# Altium project 06_TIME_STICK_279.PrjPcb (part 2 of 2)
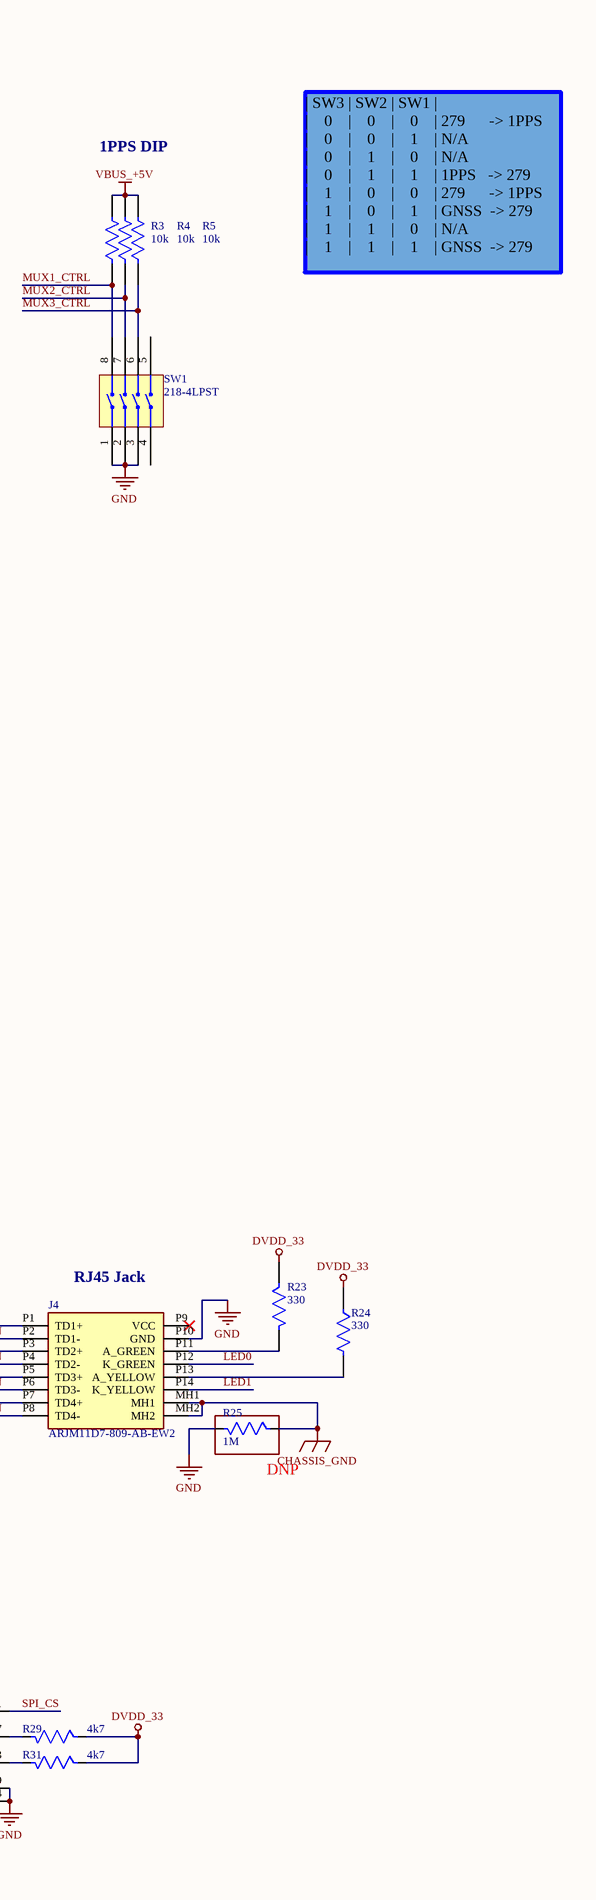
[diagram p2: Sheet1.SchDoc, right]

## Sheet Sheet1.SchDoc (continued)

### Library data of the parts
C1-C5 C8 C9 C14-C18 C20-C27 C30-C34 = CMP-13271-002758-1: Cap Ceramic 100nF 10V X7R ±10% SMD 0402 +125°C Paper T/R; Manufacturer: KEMET; Manufacturer Part Number: C0402C104K4RAC-TU; Voltage: 16V; Dissipation Factor: 3.5%; Voltage Rating: 10V; Voltage Rating (DC): 10V; Packaging: Tape and Reel; Radiation Hardening: No; Height: 0.5mm; Depth: 0.5mm; Package Quantity: 50000; Tolerance: 10%; Mount: Surface Mount; Width: 0.02inch; Thickness: 0.022inch; Max Operating Temperature: 125°C; Capacitance: 100nF; Dielectric: X7R; Case/Package: 0402; Length: 1mm; Min Operating Temperature: -55°C; Supplier: Digikey; Supplier Part Number: 399-C0402C104K4RAC7867CT-ND; RoHS: Yes; Category: Ceramic Capacitors; Stock: 3965396; Pricing: 1=0.1, 10=0.032, 50=0.0182, 100=0.0141, 500=0.0106, 1000=0.00833, 2500=0.00758, 5000=0.00697 (USD); Pins: 2; Case Code (Metric): 1005; Case Code (Imperial): 0402; Dielectric Material: Ceramic; Value: 100nF; Termination: SMD/SMT; Series: C; Reach SVHC Compliant: No
C6 C12 C13 C19 C28 = CMP-14477-004104-2: Ceramic Capacitor General Use 4.7uF ±20% 10V X5R 0402; Manufacturer: Taiyo Yuden; Manufacturer Part Number: LMK105BBJ475MVLF; Material: 4241ConductorMaterial; Case Code (Metric): 1005; Package Quantity: 10000; Max Operating Temperature: 85°C; Halogen Free: Halogen Free; Case Code (Imperial): 0402; Weight: 2.3E-05oz; Packaging: Tape and Reel; Resistor Type: Ceramic; Width: 0.02inch; Case/Package: 0402; Min Operating Temperature: -55°C; Dielectric: X5R; Length: 1mm; RoHS Compliant: Yes; Capacitance: 4.7uF; Thickness: 0.022inch; Termination: SMD/SMT; Voltage Rating (DC): 10V; Voltage Rating: 10V; Mount: Surface Mount; Tolerance: 20%; Height: 0.5mm; Supplier: Digikey; Supplier Part Number: 587-3408-1-ND; RoHS: Yes; Category: Ceramic Capacitors; Stock: 753964; Pricing: 1=0.19, 10=0.12, 50=0.076, 100=0.0607, 500=0.04386, 1000=0.03879, 2500=0.03711, 5000=0.03373 (USD); Mounting Technology: Surface Mount; Value: 4.7uF; Series: M; Construction: Flat; ComponentLink1URL: https://datasheet.ciiva.com/24462/423lmk105bbj475mvlf-24462535.pdf?src-supplier=Onlinecomponents.com; ComponentLink1Description: https://datasheet.ciiva.com/24462/423lmk105bbj475mvlf-24462535.pdf?src-supplier=Onlinecomponents.com; ComponentLink2URL: https://datasheet.ciiva.com/18697/mlcc-all-e-18697686.pdf?src-supplier=Digikey; ComponentLink2Description: https://datasheet.ciiva.com/18697/mlcc-all-e-18697686.pdf?src-supplier=Digikey; ComponentLink3URL: https://datasheet.ciiva.com/18697/mlcc-all-e-18697685.pdf?src-supplier=Digikey; ComponentLink3Description: https://datasheet.ciiva.com/18697/mlcc-all-e-18697685.pdf?src-supplier=Digikey
C7 C29 = CMP-2000-05441-1: Chip Capacitor, 22 uF, +/- 20%, 10 V, -55 to 85 degC, 0603 (1608 Metric), RoHS, Tape and Reel; Manufacturer: TDK; PCN Part Number: MLCCPartNumberChange30/Nov/2012; Manufacturer Part Number: C1608X5R1A226M080AC; Voltage - Rated: 10V; Product Training Modules: CSeriesGeneralApplicationsSEAT,CCV,andTVCLDesignToolsGuidetoReplacinganElectrolyticCapacitorwithanMLCC; Other Names: 445-9077-1; Design Resources: 20WNon-IsolatedBuckLEDDriverUsingPLLNK460KG; Online Catalog: CSeries,GeneralPurpose; Capacitance: 22µF; Temperature Coefficient: X5R; Kits: 445-9014-KIT-ND-KITMLCC100PF-22UF060310-50V; Dielectric Material: Ceramic; Material: 4241ConductorMaterial; Packaging: CutTape(CT); Standard Package: 1; Package / Case: 0603(1608Metric); Lead Style: -; Features: -; Ratings: -; Operating Temperature: -55degC~85degC; Applications: GeneralPurpose; Package Reference: 603; Datasheet URL: http://download.siliconexpert.com/pdfs/2015/4/21/15/54/45/779/tdk_/manual/37024850441143360mlcc_commercial_general_en.pdf; Datasheet Version: Mar-15; Mounting Type: SurfaceMount,MLCC; Lead Spacing: -; Size / Dimension: 0.063"Lx0.031"W(1.60mmx0.80mm); Height - Seated (Max): -; Package Description: 2-Pin Surface Mount Device, Body 1.6 x 0.8 mm; Manufacturer URL: http://www.tdk.com/; RoHS Information: RoHSCertificate-MLCC; Tolerance: ±20%; Series: C; Thickness (Max): 0.035"(0.90mm); Family: CeramicCapacitors; Category: Capacitors; Supplier: Digikey; Supplier Part Number: 445-9077-1-ND; RoHS: Yes; Stock: 1433584; Pricing: 1=0.33, 10=0.219, 50=0.1612, 100=0.1312, 500=0.1036, 1000=0.08748 (USD); Mounting Technology: Surface Mount; Case/Package: 0603; Case Code (Metric): 1608; Case Code (Imperial): 0603; Weight: 7.1E-05oz; Min Operating Temperature: -55°C; Max Operating Temperature: 85°C; Voltage Rating: 10V; Value: 22uF; Voltage Rating (DC): 10V; Dielectric: X5R; Termination: SMD/SMT; Package Quantity: 4000; Length: 1.6mm; Width: 0.8mm; Height: 0.8mm; RoHS Compliant: Yes; Lead Free: Lead Free; Reach SVHC Compliant: No; ComponentLink1URL: https://datasheet.ciiva.com/6274/tdkmlcccaprange-6274860.pdf?src-supplier=Digikey; ComponentLink1Description: https://datasheet.ciiva.com/6274/tdkmlcccaprange-6274860.pdf?src-supplier=Digikey; ComponentLink2URL: https://datasheet.ciiva.com/6274/tdkmlcccaprange-6274859.pdf?src-supplier=Digikey; ComponentLink2Description: https://datasheet.ciiva.com/6274/tdkmlcccaprange-6274859.pdf?src-supplier=Digikey; ComponentLink3URL: https://datasheet.ciiva.com/6274/tdkmlcccaprange-6274861.pdf?src-supplier=Digikey; ComponentLink3Description: https://datasheet.ciiva.com/6274/tdkmlcccaprange-6274861.pdf?src-supplier=Digikey; ComponentLink4URL: https://datasheet.ciiva.com/24216/mlcc-commercial-general-en-24216575.pdf?src-supplier=Mouser; ComponentLink4Description: https://datasheet.ciiva.com/24216/mlcc-commercial-general-en-24216575.pdf?src-supplier=Mouser
C10 C11 = CMP-03020-019954-1: CAP CER 15PF 100V C0G/NP0 0402; Manufacturer: KEMET; Manufacturer Part Number: CBR04C150F1GAC; Tolerance: 0.01; Temperature Coefficient: 30ppm/°C; Temperature Characteristic: C0G; Material: Ceramic; Temperature Range High: +125°C; Device Class L1: Passive Components; Package: CBR04C; Height: 0.55mm; RoHS: TRUE; Octopart: https://octopart.com/cbr04c150f1gac-kemet-30609229; Value: 15 pF; Temperature Range Low: -55°C; Digikey Description: CAP CER 15PF 100V C0G/NP0 0402; Mouser Description: Multilayer Ceramic Capacitors MLCC - SMD/SMT 100volts 15pF C0G 0402 1% Tol RF; Automotive: No; Temperature: -55°C to +125°C; Category: Cap; Lead Free: Yes; Capacitance: 15 pF; Ipc Land Pattern Name: CAPC10050X50; ComponentLink2Description: Datasheet; Voltage Rating: 100 V; Device Class L3: Ceramic Capacitors; Device Class L2: Capacitors; ComponentLink2URL: https://content.kemet.com/datasheets/KEM_C1030_CBR_SMD.pdf
D1 D2 = CMP-44529-000024-1: LED GREEN CLEAR CHIP SMD; Manufacturer: Kingbright; Forward Voltage: 3.3V; Dominant Wavelength: 525nm; Forward Current: 20mA; Lens Color: Colorless; Viewing Angle: 120°; Luminous Intensity: 350mcd; Lens Transparency: Clear; Color: Green; Max Operating Temperature: 85°C; Case/Package: 0603; Mount: Surface Mount; Min Operating Temperature: -40°C; Case Code (Metric): 1608; Test Current: 20mA; Packaging: Tape and Reel; Width: 0.8mm; Package Quantity: 1; Height: 0.75mm; Length: 1.6mm; Illumination Color: Green; Lead Free: Lead Free; Case Code (Imperial): 0603; Supplier: LCSC; Supplier Part Number: C5554158; Manufacturer Part Number: APT1608ZGCK; RoHS: Yes; Category: LEDs; Stock: 1770; Pricing: 5=0.3043, 50=0.2442, 150=0.2184, 500=0.1863, 2000=0.1719, 4000=0.1633 (USD); Mounting Technology: Surface Mount; Series: HELI2; RoHS Compliant: Yes; ComponentLink1URL: https://datasheet.ciiva.com/16422/apt1608zgck-262051-16422477.pdf?src-supplier=Mouser; ComponentLink1Description: https://datasheet.ciiva.com/16422/apt1608zgck-262051-16422477.pdf?src-supplier=Mouser; ComponentLink2URL: https://datasheet.ciiva.com/26292/apt1608zgck-26292289.pdf?src-supplier=Digikey; ComponentLink2Description: https://datasheet.ciiva.com/26292/apt1608zgck-26292289.pdf?src-supplier=Digikey; ComponentLink3URL: https://datasheet.ciiva.com/29562/apt1608zgck-29562277.pdf?src-supplier=Digikey; ComponentLink3Description: https://datasheet.ciiva.com/29562/apt1608zgck-29562277.pdf?src-supplier=Digikey
FB1-FB4 = CMP-0686-00284-4: Chip Ferrite Bead, 0402, 80Ω @ 100MHz, 0.07Ω, 25%, 1.5A; Manufacturer: Murata; Number of Lines: 1; DC Resistance-Max: 70mR; Impedance: 80R; Height: 0.5mm; Package Quantity: 1; RoHS Compliant: Yes; Max Operating Temperature: 125°C; Depth: 0.5mm; Max Current Rating: 1.5A; Max DC Current: 1.5A; Current Rating: 1.5A; Number of Pins: 2; Case Code (Imperial): 0402; Case/Package: 0402; Case Code (Metric): 1005; Material: Ferrite; Packaging: Tape and Reel; REACH SVHC: No SVHC; Length: 1mm; Tolerance: 25%; Termination: SMD/SMT; Series: BLM15PD; Number of Circuits: 1; Test Frequency: 100MHz; DC Resistance (DCR): 70mR; Min Operating Temperature: -55°C; Lead Free: Lead Free; Width: 0.5mm; Supplier: Digikey; Supplier Part Number: 490-5202-1-ND; Manufacturer Part Number: BLM15PD800SN1D; RoHS: Yes; Category: Ferrite Beads and Chips; Stock: 94761; Pricing: 1=0.1, 10=0.068, 25=0.0616, 50=0.0556, 100=0.0408, 250=0.02968, 500=0.0272, 1000=0.02348, 5000=0.01854 (USD); Pins: 2; Reach SVHC Compliant: No; ComponentLink1URL: https://datasheet.ciiva.com/41449/001172208-da-01-en-drossel-0402-80r-1-0x0-5mm-10000st-41449497.pdf?src-supplier=Conrad; ComponentLink1Description: https://datasheet.ciiva.com/41449/001172208-da-01-en-drossel-0402-80r-1-0x0-5mm-10000st-41449497.pdf?src-supplier=Conrad; ComponentLink2URL: https://datasheet.ciiva.com/1012/l0110e-1012441.pdf?src-supplier=Digikey; ComponentLink2Description: https://datasheet.ciiva.com/1012/l0110e-1012441.pdf?src-supplier=Digikey; ComponentLink3URL: https://datasheet.ciiva.com/1012/l0110e-1012440.pdf?src-supplier=Digikey; ComponentLink3Description: https://datasheet.ciiva.com/1012/l0110e-1012440.pdf?src-supplier=Digikey; ComponentLink4URL: https://datasheet.ciiva.com/1012/l0110e-1012442.pdf?src-supplier=Digikey; ComponentLink4Description: https://datasheet.ciiva.com/1012/l0110e-1012442.pdf?src-supplier=Digikey; ComponentLink5URL: https://datasheet.ciiva.com/16420/l0110s0100blm15pgblm15pd-16420757.pdf?src-supplier=Future+Electronics; ComponentLink5Description: https://datasheet.ciiva.com/16420/l0110s0100blm15pgblm15pd-16420757.pdf?src-supplier=Future+Electronics
J1 = CMP-04764-000006-1: CONN SMA JACK STR 50 OHM SMD; Manufacturer: Molex; Manufacturer Series: 73251; Is Female: yes; Standoff Height: 0.41mm; Impedance: 50Ω; Number Of Contacts: 1; Conn Orientation: Straight; Voltage Rating: 500V; Shielding: true; Frequency: 18GHz; Characteristic Impedance: 50R; Contact Resistance: 3mR; Contact Style: Coax; Dielectric Withstanding Voltage (AC): 1.4kV; Durability: 500Cycles; Insertion Loss: 0.17dB; Insulation Resistance: 5GR; Operating Frequency-Max: 18kHz; VSWR: 1.07; Body Depth: 0.375inch; Mounting Option 1: LOCKING; Reliability: COMMERCIAL; Package: 73251-1350; Device Class L1: Connectors; Category: Conn; Manufacturer Part Number: 73251-1350; ComponentLink2URL: https://www.molex.com/pdm_docs/sd/732511350_sd.pdf; Automotive: No; Height: 9.655mm; Octopart: https://octopart.com/73251-1350-molex-5414390; Footprint Url: https://forum.upverter.com/uploads/default/original/3X/d/a/daeafa2ce4908d4fc4e49f0b17d7d2c986fce444.pdf; Temperature Range High: +165°C; Device Class L3: unset; Mouser Description: RF Connectors / Coaxial Connectors SMA ST PCB-JCK STD SMT; Lead Free: Yes; Temperature: -65°C to +165°C; RoHS: TRUE; ComponentLink2Description: Datasheet; Device Class L2: RF / Coaxial Connectors; Digikey Description: CONN SMA JACK STR 50 OHM SMD; Contact Material: Gold; Temperature Range Low: -65°C; Supplier: Digikey; Supplier Part Number: WM9357-ND; Stock: 5647; Pricing: 1=4.22, 10=3.712, 80=2.95275, 1600=2.36223, 3200=2.27786 (USD); Mounting Technology: Board; Contact Finish - Mating: NOT SPECIFIED; Insulation Material: Teflon; Shell Finish: Gold; Shell Material: Brass; Min Operating Temperature: -65°C; Max Operating Temperature: 165°C; Connector Type: SMA; Body/Shell Style: JACK; Contact Gender: Female; Mounting Style: STRAIGHT; Termination: SMD/SMT; Number of Ports: 1; Panel Mount: Yes; RoHS Compliant: Yes; Reach SVHC Compliant: No; ComponentLink1URL: https://datasheet.ciiva.com:443/pdfs/VipMasterIC/IC/MOLE/MOLE-S-A0001396055/MOLE-S-A0001473074-1.pdf?src-supplier=IHS+Markit; ComponentLink1Description: https://datasheet.ciiva.com:443/pdfs/VipMasterIC/IC/MOLE/MOLE-S-A0001396055/MOLE-S-A0001473074-1.pdf?src-supplier=IHS+Markit
J2 = CMP-CON-00539-2: CONN, B2C/W, HEADER, 5-POS, 1.00MM PITCH, 2.90MM H, RA, TIN, SMT; Manufacturer: JST Sales America Inc.; Internal Part Number: 830-02819-00; Rows: 1; Shrouded: Shrouded - 4 Wall; System: Connector; Insulation: Polyamide (PA), Nylon; Current Rating: 0.7A; Pitch: 0.039" (1.00mm); Style: Board to Cable/Wire; Number of Positions/Contacts: 5; Voltage Rating: 50V; Contact Material: Copper Alloy; Supplier Part Number 1: 455-SM05B-SRSS-G-TBTR-ND; Category: Headers, Male Pins; Color: Natural; Series: SH/SR; Supplier 1: Digikey; Max Operating Temperature: 85°C; Contact Shape: Square; Contact Finish: Tin; Mounting Type: Surface Mount, Right Angle; Part Status: Active; Contact Type: Male Pin; Termination: Solder; Datasheet URL: https://www.jst-mfg.com/product/pdf/eng/eSH.pdf?65e8c309183bb; Signal Pins: 5; Height: 0.114" (2.90mm); RoHS: Yes; Features: Solder Retention; Min Operating Temperature: -25°C; Connector Type: Header
J3 = CONN_GSB316441CEU: Conn USB 3.0 Type A PL 9 POS Solder RA SMD 9 Terminal 1 Port; Manufacturer: Amphenol Commercial; MF: Amphenol; Current Rating: 1.8A; Number of Contacts: 9; SnapEDA_Link: https://www.snapeda.com/parts/GSB316441CEU/Amphenol/view-part/?ref=snap; Package: None; Value: *; MP: GSB316441CEU; Check_prices: https://www.snapeda.com/parts/GSB316441CEU/Amphenol/view-part/?ref=eda; Supplier: Digikey; Supplier Part Number: GSB316441CEUCT-ND; Manufacturer Part Number: GSB316441CEU; RoHS: Yes; Category: USB Connectors; Stock: 13312; Pricing: 1=2.04, 10=1.775, 25=1.6996, 50=1.6618, 100=1.5863, 250=1.43524 (USD); Mounting Technology: Surface Mount,Horizontal; Contact Material: Copper Alloy; Contact Plating: Gold; Package Quantity: 1; Packaging: Tape and Reel; Connector Type: USB; Termination: SMD/SMT; Orientation: Right Angle; Series: GSB3; Radiation Hardening: No; RoHS Compliant: Yes; ComponentLink1URL: https://datasheet.ciiva.com/10945/gsb316441ceu-10945197.pdf?src-supplier=Avnet; ComponentLink1Description: https://datasheet.ciiva.com/10945/gsb316441ceu-10945197.pdf?src-supplier=Avnet; Supplier 1: Digikey; Supplier Part Number 1: GSB316441CEUCT-ND
J4 = ARJM11D7-809-AB-EW2: Connector; Manufacturer_Name: ABRACON; Datasheet Link: https://abracon.com/Magnetics/ARJM11.pdf; Height: 14.05mm; Manufacturer_Part_Number: ARJM11D7-809-AB-EW2; Mouser Part Number: 815-RJM11D7809ABEW2; Mouser Price/Stock: https://www.mouser.co.uk/ProductDetail/ABRACON/ARJM11D7-809-AB-EW2?qs=YCa%2FAAYMW03gbQ6lIqrJ2w%3D%3D; Arrow Part Number: ARJM11D7-809-AB-EW2; Arrow Price/Stock: null?region=nac
L1 L2 = CMP-06042-016211-1: Multilayer Type Inductor for Power Lines, 1008 (2520), 3.3μH, 20%, 0.125Ω, 1.2A; Manufacturer: Murata; Manufacturer Part Number: LQM2HPN3R3MG0L; Self Resonant Frequency: 30MHz; Inductance: 3.3uH; Shielding: Shielded; DC Resistance (DCR): 125mR; Test Frequency: 1MHz; Core Material: Ferrite; Value: 3.3uH; Case Code (Imperial): 1008; Width: 2mm; Lead Free: Lead Free; Inductance Tolerance: 20%; Radiation Hardening: No; Mount: Surface Mount; Packaging: Tape and Reel; Case Code (Metric): 2520; Height: 0.9mm; Military Standard: Not; Tolerance: 20%; Max DC Current: 1.2A; Min Operating Temperature: -55°C; Length: 2.5mm; Depth: 2.2mm; Case/Package: 1008; Max Operating Temperature: 125°C; Series: LQM2HP_G0; RoHS Compliant: Yes; Height - Seated (Max): 0.039inch; REACH SVHC: No SVHC; DC Current: 1.2A; Package Quantity: 3000; Termination: SMD/SMT; Current Rating: 1.2A; Supplier: Digikey; Supplier Part Number: 490-5115-1-ND; RoHS: Yes; Category: Fixed Inductors; Stock: 32510; Pricing: 1=0.21, 10=0.171, 25=0.1576, 50=0.1444, 100=0.1274, 250=0.12344, 500=0.11032, 1000=0.0893 (USD); Mounting Technology: Surface Mount; Reach SVHC Compliant: No; ComponentLink1URL: https://datasheet.ciiva.com/30490/0900766b812561d9-30490184.pdf?src-supplier=Rs; ComponentLink1Description: https://datasheet.ciiva.com/30490/0900766b812561d9-30490184.pdf?src-supplier=Rs; ComponentLink2URL: https://datasheet.ciiva.com/1042/l0075s0104lqm2hp-g0-1042940.pdf?src-supplier=Digikey; ComponentLink2Description: https://datasheet.ciiva.com/1042/l0075s0104lqm2hp-g0-1042940.pdf?src-supplier=Digikey; ComponentLink3URL: https://datasheet.ciiva.com/1042/l0075s0104lqm2hp-g0-1042941.pdf?src-supplier=Digikey; ComponentLink3Description: https://datasheet.ciiva.com/1042/l0075s0104lqm2hp-g0-1042941.pdf?src-supplier=Digikey; ComponentLink4URL: https://datasheet.ciiva.com/1042/l0075s0104lqm2hp-g0-1042942.pdf?src-supplier=Digikey; ComponentLink4Description: https://datasheet.ciiva.com/1042/l0075s0104lqm2hp-g0-1042942.pdf?src-supplier=Digikey; ComponentLink5URL: https://datasheet.ciiva.com/8509/l0075s0104lqm2hp-g0-8509087.pdf?src-supplier=Avnet; ComponentLink5Description: https://datasheet.ciiva.com/8509/l0075s0104lqm2hp-g0-8509087.pdf?src-supplier=Avnet
R1 R2 R7 R8 R14 R15 R21 R28 R29 R31 = CMP-2002-02814-2: RES SMD 4.7K OHM 0.1% 1/16W 0402; Manufacturer: Yageo; Manufacturer Part Number: RT0402BRD074K7L; Voltage Rating: 50V; Temperature Coefficient: 25 ppm/°C; Resistance: 4.7KΩ; Tolerance: 0.001; Power Rating: 0.063W; Value: 4.7KΩ; Device Class L2: Resistors; Composition: Thin Film; Octopart: https://octopart.com/rt0402brd074k7l-yageo-1415343; Mouser Description: Thin Film Resistors 1/16W 4.7K ohm .1% 25ppm; Lead Free: Yes; Height: 0.35mm; Automotive: No; Series: RT; Ipc Land Pattern Name: RESC10050X30; Package: RT0402; Category: Res; Temperature Range High: +155°C; Footprint Url: http://www.yageo.com/exep/pages/download/literatures/PYu-R_Mount_10.pdf; Temperature Range Low: -55°C; Device Class L3: Chip SMD Resistors; RoHS: TRUE; ComponentLink2URL: http://www.yageo.com/documents/recent/PYu-RT_1-to-0.01_RoHS_L_9.pdf; Digikey Description: RES SMD 4.7K OHM 0.1% 1/16W 0402; Temperature: -55°C to +155°C; Device Class L1: Passive Components; ComponentLink2Description: Datasheet
R3-R5 R11 R32 = CMP-26527-000128-1: 10kΩ ±1% 0.063W 0402 Thick Film Chip Resistor AEC-Q200 compliant; Manufacturer: Stackpole Electronics; Manufacturer Part Number: RMCF0402FT10K0; Temperature Coefficient: 100ppm/°C; Power Rating: 62.5mW; Resistance: 10kR; Max Power Dissipation: 63mW; Value: 10kR; Width: 0.02inch; Case/Package: 0402; Depth: 0.5mm; Resistor Type: Thick Film; Series: RMCF; Length: 1mm; Contact Plating: Tin; Tolerance: 1%; Number of Terminations: 2; Height: 0.016inch; Military Standard: Not; Case Code (Imperial): 0402; Size Code: 0402; Construction: Rectangular; Radiation Hardening: No; RoHS Compliant: Yes; Case Code (Metric): 1005; Packaging: Tape and Reel; Lead Free: Lead Free; Min Operating Temperature: -55°C; Max Operating Temperature: 155°C; Mount: Surface Mount; Features: Automotive AEC-Q200; Supplier: Digikey; Supplier Part Number: RMCF0402FT10K0CT-ND; RoHS: Yes; Category: Chip SMD Resistors; Stock: 16567212; Pricing: 1=0.1, 10=0.021, 50=0.0116, 100=0.0093, 500=0.00594, 1000=0.005, 5000=0.00345 (USD); Mounting Technology: Surface Mount; Ratings: AEC-Q200; ComponentLink1URL: https://datasheet.ciiva.com/24341/sei-rmcp-24341800.pdf?src-supplier=Onlinecomponents.com; ComponentLink1Description: https://datasheet.ciiva.com/24341/sei-rmcp-24341800.pdf?src-supplier=Onlinecomponents.com
R6 R9 R26 = CMP-2002-05495-2: Thick Film Chip Resistors 0402 0Ω 0.0625W 5%; Manufacturer: Bourns; Manufacturer Part Number: CR0402-J/-000GLF; Manufacturer Series: CR0402; Voltage Rating (DC): 50V; Max Power Dissipation: 63mW; Temperature Coefficient: 500ppm/°C; Resistance: 0mR; Power Rating: 62.5mW; Value: 0R; Depth: 0.5mm; Packaging: Tape and Reel; REACH SVHC: No SVHC; Max Operating Temperature: 125°C; Case Code (Metric): 1005; Case Code (Imperial): 0402; Case/Package: 0402; Number of Pins: 2; Thickness: 356um; Composition: Thick Film; Voltage Rating: 50V; Min Operating Temperature: -55°C; Tolerance: 5%; Radiation Hardening: No; Height: 0.35mm; Termination: SMD/SMT; Width: 0.5mm; Mount: Surface Mount; Package Quantity: 10000; Contact Plating: Tin; Length: 1mm; Supplier: LCSC; Supplier Part Number: C203078; RoHS: Yes; Category: Chip SMD Resistors; Stock: 2300; Pricing: 100=0.004, 1000=0.0033, 3000=0.0029, 10000=0.0026, 50000=0.0024, 100000=0.0023 (USD); Mounting Technology: Surface Mount; Pins: 2NUMBER; Package Shape: Rectangular; Terminal Finish: Tin; Resistor Type: Thick Film; Series: CR0402; Number of Terminations: 2; Resistance Tolerance: 5%; Technology: THICK FILM; RoHS Compliant: Yes; Reach SVHC Compliant: No; ComponentLink1URL: https://datasheet.ciiva.com/11811/0900766b80fcdb41-11811721.pdf?src-supplier=Rs; ComponentLink1Description: https://datasheet.ciiva.com/11811/0900766b80fcdb41-11811721.pdf?src-supplier=Rs; ComponentLink2URL: https://datasheet.ciiva.com/19466/774727-19466474.pdf?src-supplier=Jameco; ComponentLink2Description: https://datasheet.ciiva.com/19466/774727-19466474.pdf?src-supplier=Jameco; ComponentLink3URL: https://datasheet.ciiva.com/7986/cr0402-7986154.pdf?src-supplier=Element14; ComponentLink3Description: https://datasheet.ciiva.com/7986/cr0402-7986154.pdf?src-supplier=Element14; ComponentLink4URL: https://datasheet.ciiva.com/9116/cr0402-9116774.pdf?src-supplier=Avnet; ComponentLink4Description: https://datasheet.ciiva.com/9116/cr0402-9116774.pdf?src-supplier=Avnet; ComponentLink5URL: https://datasheet.ciiva.com/6549/cr0402-6549983.pdf?src-supplier=Digikey; ComponentLink5Description: https://datasheet.ciiva.com/6549/cr0402-6549983.pdf?src-supplier=Digikey; ComponentLink6URL: https://datasheet.ciiva.com/30262/cr0402-30262110.pdf?src-supplier=Onlinecomponents.com; ComponentLink6Description: https://datasheet.ciiva.com/30262/cr0402-30262110.pdf?src-supplier=Onlinecomponents.com
R10 = CMP-1011-00702-2: Manufacturer: Bourns; Part Number: CR0402-FX-4992GLF; Tolerance: 1%; Power: 62.5mW; Value: 49.9kR; Temperature Coefficient: 100ppm/°C; Working Voltage: 50V; Rated Temperature: 70°C; Package Height: 0.35mm; Package Length: 1mm; Package Width: 0.5mm; Supplier: Digikey; Supplier Part Number: CR0402-FX-4992GLFCT-ND; Manufacturer Part Number: CR0402-FX-4992GLF; RoHS: Yes; Category: Chip SMD Resistors; Stock: 654471; Pricing: 1=0.1, 10=0.012, 50=0.007, 100=0.0056, 500=0.00356, 1000=0.003, 5000=0.00207 (USD); Mounting Technology: Surface Mount; Pins: 2; Case/Package: 0402; Package Shape: Rectangular; Terminal Finish: Nickel; Min Operating Temperature: -55°C; Max Operating Temperature: 125°C; Resistor Type: FIXED RESISTOR; Packaging: Tape and Reel; Termination: Wraparound; Technology: RUTHENIUM OXIDE; Construction: Chip; Package Style: SMTMeter; JESD-609 Code: e3; RoHS Compliant: Yes; Reach SVHC Compliant: No; ComponentLink1URL: https://datasheet.ciiva.com:443/pdfs/VipMasterIC/IC/BOUR/BOUR-S-A0008953887/BOUR-S-A0008953887-1.pdf?src-supplier=IHS+Markit; ComponentLink1Description: https://datasheet.ciiva.com:443/pdfs/VipMasterIC/IC/BOUR/BOUR-S-A0008953887/BOUR-S-A0008953887-1.pdf?src-supplier=IHS+Markit; ComponentLink2URL: https://datasheet.ciiva.com/5589/cr0402-5589723.pdf?src-supplier=Mouser; ComponentLink2Description: https://datasheet.ciiva.com/5589/cr0402-5589723.pdf?src-supplier=Mouser; ComponentLink3URL: https://datasheet.ciiva.com/25647/cr0402-25647303.pdf?src-supplier=Digikey; ComponentLink3Description: https://datasheet.ciiva.com/25647/cr0402-25647303.pdf?src-supplier=Digikey; ComponentLink4URL: https://datasheet.ciiva.com/29711/cr0402-29711613.pdf?src-supplier=Digikey; ComponentLink4Description: https://datasheet.ciiva.com/29711/cr0402-29711613.pdf?src-supplier=Digikey; ComponentLink5URL: https://datasheet.ciiva.com/29711/cr0402-29711614.pdf?src-supplier=Digikey; ComponentLink5Description: https://datasheet.ciiva.com/29711/cr0402-29711614.pdf?src-supplier=Digikey; ComponentLink6URL: https://datasheet.ciiva.com/9121/cr0402-9121263.pdf?src-supplier=Avnet; ComponentLink6Description: https://datasheet.ciiva.com/9121/cr0402-9121263.pdf?src-supplier=Avnet
R12 = CMP-1011-00736-2: Part Number: CRCW0402100KFKTD; Manufacturer: Vishay Dale; Tolerance: 1%; Power: 63mW; Rated Temperature: 70°C; Value: 100kR; Temperature Coefficient: 100ppm/°C; Working Voltage: 50V; Package Height: 0.35mm; Package Length: 1mm; Package Width: 0.5mm; Reference Standard: AEC-Q200; Supplier: Digikey; Supplier Part Number: 541-CRCW0402100KFKTDCT-ND; Manufacturer Part Number: CRCW0402100KFKTD; RoHS: No; Category: Chip SMD Resistors; Stock: 51733; Pricing: 1=0.15, 10=0.075, 50=0.0502, 100=0.0428, 500=0.03068, 1000=0.027, 5000=0.0207 (USD); Mounting Technology: Surface Mount; Pins: 2; Case/Package: 0402; Package Shape: Rectangular; Terminal Finish: Nickel; Min Operating Temperature: -55°C; Max Operating Temperature: 155°C; Resistor Type: FIXED RESISTOR; Packaging: Tape and Reel; Termination: Wraparound; JESD-609 Code: e0; Construction: Chip; Package Style: SMTMeter; Technology: METAL GLAZE/THICK FILM; RoHS Compliant: No; Reach SVHC Compliant: No; ComponentLink1URL: https://datasheet.ciiva.com:443/pdfs/VipMasterIC/IC/VISH/VISH-S-A0002183699/VISH-S-A0002183699-1.pdf?src-supplier=IHS+Markit; ComponentLink1Description: https://datasheet.ciiva.com:443/pdfs/VipMasterIC/IC/VISH/VISH-S-A0002183699/VISH-S-A0002183699-1.pdf?src-supplier=IHS+Markit; ComponentLink2URL: https://datasheet.ciiva.com/3883/dcrcw-3883348.pdf?src-supplier=Arrow+Electronics; ComponentLink2Description: https://datasheet.ciiva.com/3883/dcrcw-3883348.pdf?src-supplier=Arrow+Electronics; ComponentLink3URL: https://datasheet.ciiva.com/26944/getdatasheetpartid-104148-26944497.pdf?src-supplier=Verical; ComponentLink3Description: https://datasheet.ciiva.com/26944/getdatasheetpartid-104148-26944497.pdf?src-supplier=Verical; ComponentLink4URL: https://datasheet.ciiva.com/2563/dcrcw-2563010.pdf?src-supplier=Digikey; ComponentLink4Description: https://datasheet.ciiva.com/2563/dcrcw-2563010.pdf?src-supplier=Digikey; ComponentLink5URL: https://datasheet.ciiva.com/8982/dcrcw-8982555.pdf?src-supplier=Avnet; ComponentLink5Description: https://datasheet.ciiva.com/8982/dcrcw-8982555.pdf?src-supplier=Avnet
R13 = CMP-2002-03028-2: RES SMD 24K OHM 1% 1/16W 0402; Manufacturer Part Number: RT0402FRE0724KL; Manufacturer: Yageo; Power Rating: 0.063W; Tolerance: 0.01; Voltage Rating: 50V; Value: 24KΩ; Temperature Coefficient: 50 ppm/°C; Automotive: No; Ipc Land Pattern Name: RESC10050X30; Footprint Url: http://www.yageo.com/exep/pages/download/literatures/PYu-R_Mount_10.pdf; Category: Res; Height: 0.35mm; RoHS: TRUE; Lead Free: Yes; Device Class L1: Passive Components; Series: RT; Package: RT0402; Device Class L2: Resistors; ComponentLink2URL: http://www.yageo.com/documents/recent/PYu-RT_1-to-0.01_RoHS_L_9.pdf; Temperature Range High: +155°C; Digikey Description: RES SMD 24K OHM 1% 1/16W 0402; Temperature: -55°C to +155°C; Octopart: https://octopart.com/rt0402fre0724kl-yageo-1380387; Resistance: 24KΩ; Composition: Thin Film; Device Class L3: Chip SMD Resistors; ComponentLink2Description: Datasheet; Temperature Range Low: -55°C
R16 R17 R20 = CMP-2002-03778-1: Part Number: RK73B1ETTP473J; Manufacturer: KOA Speer; Tolerance: 5%; Power: 100mW; Rated Temperature: 70°C; Value: 47kR; Temperature Coefficient: 200ppm/°C; Working Voltage: 50V; Package Height: 0.35mm; Package Length: 1mm; Package Width: 0.5mm; Reference Standard: AEC-Q200; Supplier: Digikey; Supplier Part Number: 2019-RK73B1ETTP473JCT-ND; Manufacturer Part Number: RK73B1ETTP473J; RoHS: Yes; Category: Chip SMD Resistors; Stock: 25570; Pricing: 1=0.1, 10=0.017, 50=0.0104, 100=0.0087, 500=0.0058, 1000=0.00494, 5000=0.00355 (USD); Mounting Technology: Surface Mount; Pins: 2; Case/Package: 0402; Terminal Finish: Nickel; Min Operating Temperature: -55°C; Max Operating Temperature: 155°C; Resistor Type: FIXED RESISTOR; Technology: METAL GLAZE/THICK FILM; Termination: Wraparound; JESD-609 Code: e3; Construction: Rectangular; Package Style: SMTMeter; Packaging: Tape and Reel; RoHS Compliant: Yes; Reach SVHC Compliant: Yes; ComponentLink1URL: https://datasheet.ciiva.com:443/pdfs/VipMasterIC/IC/KOAS/KOAS-S-A0009586303/KOAS-S-A0009586303-1.pdf?src-supplier=IHS+Markit; ComponentLink1Description: https://datasheet.ciiva.com:443/pdfs/VipMasterIC/IC/KOAS/KOAS-S-A0009586303/KOAS-S-A0009586303-1.pdf?src-supplier=IHS+Markit; ComponentLink2URL: https://datasheet.ciiva.com/5556/rk73b-5556607.pdf?src-supplier=Mouser; ComponentLink2Description: https://datasheet.ciiva.com/5556/rk73b-5556607.pdf?src-supplier=Mouser; ComponentLink3URL: https://datasheet.ciiva.com/15218/getdatasheetpartid-72374-15218893.pdf?src-supplier=Verical; ComponentLink3Description: https://datasheet.ciiva.com/15218/getdatasheetpartid-72374-15218893.pdf?src-supplier=Verical
R18 R19 = CRCW04020000Z0EDHP: RES SMD 0 OHM JUMPER 1/5W 0402; Manufacturer: Vishay Dale; Power (Watts): 0.2W, 1/5W; Part Number: CRCW04020000Z0EDHP; Value: 0 Ohms; ComponentLink1Description: Datasheet; ComponentLink1URL: http://www.vishay.com/docs/20043/crcwhpe3.pdf; ComponentLink2Description: DigiKey Link; ComponentLink2URL: https://www.digikey.com/en/products/detail/vishay-dale/CRCW04020000Z0EDHP/2222496; Composition: Thick Film; Device Package: 0402 (1005 Metric); Features: Automotive AEC-Q200, Pulse Withstanding; Height - Seated (Max): 0.016" (0.40mm); LastUpdated: 2/9/2024 8:30:21 PM; Lifecycle Status: Active; Minimum Order: 1; Number of Terminations: 2; Operating Temperature: -55°C ~ 155°C; Package / Case: 0402 (1005 Metric); Packaging: TapeAndReel; PartId: 3131; Part Status: Active; Price: 0.01; Ratings: AEC-Q200; Resistance: 0 Ohms; Series: CRCW-HP; Size / Dimension: 0.039" L x 0.020" W (1.00mm x 0.50mm); Supplier 1: DigiKey; Supplier Part Number 1: 541-0.0YBCT-ND; Supplier Device Package: 0402; Tolerance: Jumper
R22 R25 = CMP-26527-001513-1: 1MΩ ±5% 0.063W 0402 Thick Film Chip Resistor AEC-Q200 compliant; Manufacturer: Stackpole Electronics; Manufacturer Part Number: RMCF0402JT1M00; Power Rating: 63mW; Temperature Coefficient: 100ppm/°C; Resistance: 1MR; Working Voltage: 50V; Value: 1MR; Number of Terminations: 2; Resistor Type: Thick Film; Case/Package: 0402; Length: 0.039inch; Min Operating Temperature: -55°C; Mount: Surface Mount; Max Operating Temperature: 155°C; Depth: 0.5mm; Height: 0.016inch; Tolerance: 5%; RoHS Compliant: Yes; Construction: Rectangular; Contact Plating: Tin; Case Code (Imperial): 0402; Features: Automotive AEC-Q200; Radiation Hardening: No; Military Standard: Not; Case Code (Metric): 1005; Max Power Dissipation: 63mW; Packaging: Tape and Reel; Series: RMCF; Lead Free: Lead Free; Technology: THICK FILM; Width: 0.02inch; Supplier: Digikey; Supplier Part Number: RMCF0402JT1M00CT-ND; RoHS: Yes; Category: Chip SMD Resistors; Stock: 22890; Pricing: 1=0.1, 10=0.016, 50=0.009, 100=0.0072, 500=0.00462, 1000=0.00389, 5000=0.00269 (USD); Mounting Technology: Surface Mount; ComponentLink1URL: https://datasheet.ciiva.com/26946/getdatasheetpartid-791049-26946706.pdf?src-supplier=Verical; ComponentLink1Description: https://datasheet.ciiva.com/26946/getdatasheetpartid-791049-26946706.pdf?src-supplier=Verical
R23 R24 = CMP-13261-004965-1: Res Thick Film 0402 330Ω 1% 0.063W ±100ppm/°C Molded SMD T/R; Manufacturer: Samsung; Manufacturer Part Number: RC1005F331CS; Resistance: 330R; Max Power Dissipation: 63mW; Value: 330R; Contact Plating: Tin; Case/Package: 0402; Width: 0.02inch; Min Operating Temperature: -55°C; Composition: Thick Film; Package Quantity: 1; Length: 0.039inch; Case Code (Imperial): 0402; Case Code (Metric): 1005; Height: 0.016inch; Features: Moisture Resistant; Radiation Hardening: No; Military Standard: Not; Depth: 0.5mm; Temperature Coefficient: 100ppm/°C; Max Operating Temperature: 155°C; Packaging: Tape and Reel; Tolerance: 1%; Number of Terminations: 2; Power Rating: 63mW; Supplier: Digikey; Supplier Part Number: 1276-3976-1-ND; RoHS: Yes; Category: Chip SMD Resistors; Stock: 6645; Pricing: 1=0.1, 10=0.034, 50=0.0224, 100=0.0188, 500=0.01312, 1000=0.01142, 5000=0.0085 (USD); Series: RC; RoHS Compliant: Yes; ComponentLink1URL: https://datasheet.ciiva.com/16481/rc-series-16481001.pdf?src-supplier=Future+Electronics; ComponentLink1Description: https://datasheet.ciiva.com/16481/rc-series-16481001.pdf?src-supplier=Future+Electronics
R27 = CMP-2002-03738-1: Manufacturer: KOA Speer; Part Number: RK73B1ETTP201J; Value: 200R; Tolerance: 5%; Power Rating: 63mW; Temperature Coefficient: 200ppm/°C; Voltage Rating: 50V; Supplier: Digikey; Supplier Part Number: 2019-RK73B1ETTP201JCT-ND; Manufacturer Part Number: RK73B1ETTP201J; RoHS: Yes; Category: Chip SMD Resistors; Stock: 533194; Pricing: 1=0.1, 10=0.017, 50=0.0104, 100=0.0087, 500=0.0058, 1000=0.00494, 5000=0.00355 (USD); Mounting Technology: Surface Mount; Case/Package: 0402; Case Code (Imperial): 0402; Case Code (Metric): 1005; Min Operating Temperature: -55°C; Max Operating Temperature: 155°C; Packaging: Tape and Reel; Series: RK73B; Voltage Rating (DC): 50V; Package Quantity: 10000; Termination: SMD/SMT; Construction: Rectangular; Technology: THICK FILM; Length: 1mm; Width: 0.5mm; Height: 0.35mm; Depth: 0.5mm; RoHS Compliant: Yes; Lead Free: Lead Free; Military Standard: MIL-R-55342F; ComponentLink1URL: https://datasheet.ciiva.com/27054/1876901-27054398.pdf?src-supplier=Jameco; ComponentLink1Description: https://datasheet.ciiva.com/27054/1876901-27054398.pdf?src-supplier=Jameco; ComponentLink2URL: https://datasheet.ciiva.com/15202/getdatasheetpartid-170798-15202604.pdf?src-supplier=Verical; ComponentLink2Description: https://datasheet.ciiva.com/15202/getdatasheetpartid-170798-15202604.pdf?src-supplier=Verical; ComponentLink3URL: https://datasheet.ciiva.com/5555/rk73b-5555653.pdf?src-supplier=Mouser; ComponentLink3Description: https://datasheet.ciiva.com/5555/rk73b-5555653.pdf?src-supplier=Mouser
R30 = CMP-2002-07182-1: Part Number: RC0402FR-1322RL; Manufacturer: Yageo / Phycomp; Tolerance: 1%; Power: 62.5mW; Rated Temperature: 70°C; Temperature Coefficient: 100ppm/°C; Working Voltage: 50V; Additional Feature: LASER TRIMMABLE; Package Height: 0.35mm; Package Length: 1mm; Package Width: 0.5mm; Supplier: Digikey; Supplier Part Number: 13-RC0402FR-1322RLCT-ND; Manufacturer Part Number: RC0402FR-1322RL; RoHS: Yes; Category: Chip SMD Resistors; Stock: 43771; Pricing: 1=0.1, 10=0.015, 50=0.0088, 100=0.0073, 500=0.00488, 1000=0.00417, 5000=0.00297, 10000=0.00261 (USD); Mounting Technology: Surface Mount; Pins: 2; Case/Package: 0402; Package Shape: Rectangular; Terminal Finish: Nickel; Min Operating Temperature: -55°C; Max Operating Temperature: 155°C; Resistor Type: FIXED RESISTOR; Packaging: Tape and Reel; Value: 22R; Technology: METAL GLAZE/THICK FILM; Construction: Chip; Package Style: SMTMeter; Termination: Wraparound; JESD-609 Code: e3; RoHS Compliant: Yes; Reach SVHC Compliant: Yes; ComponentLink1URL: https://datasheet.ciiva.com:443/pdfs/VipMasterIC/IC/YAGO/YAGO-S-A0008145938/YAGO-S-A0008145938-1.pdf?src-supplier=IHS+Markit; ComponentLink1Description: https://datasheet.ciiva.com:443/pdfs/VipMasterIC/IC/YAGO/YAGO-S-A0008145938/YAGO-S-A0008145938-1.pdf?src-supplier=IHS+Markit; ComponentLink2URL: https://datasheet.ciiva.com/8890/pyu-rc0402-51-rohs-l-6-8890187.pdf?src-supplier=Avnet; ComponentLink2Description: https://datasheet.ciiva.com/8890/pyu-rc0402-51-rohs-l-6-8890187.pdf?src-supplier=Avnet; ComponentLink3URL: https://datasheet.ciiva.com/17423/pyu-rc0402-51-rohs-l-6-r-17423721.pdf?src-supplier=Future+Electronics; ComponentLink3Description: https://datasheet.ciiva.com/17423/pyu-rc0402-51-rohs-l-6-r-17423721.pdf?src-supplier=Future+Electronics
R33 = CMP-2002-07644-1: Part Number: RC0402FR-0739K2L; Manufacturer: Yageo; Tolerance: 1%; Power: 62.5mW; Value: 39.2kR; Temperature Coefficient: 100ppm/°C; Working Voltage: 50V; Rated Temperature: 70°C; Additional Feature: LASER TRIMMABLE; Package Height: 0.35mm; Package Length: 1mm; Package Width: 0.5mm; Supplier: Digikey; Supplier Part Number: 311-39.2KLRCT-ND; Manufacturer Part Number: RC0402FR-0739K2L; RoHS: Yes; Category: Chip SMD Resistors; Stock: 204222; Pricing: 1=0.1, 10=0.015, 50=0.0088, 100=0.0073, 500=0.00488, 1000=0.00417, 5000=0.00297 (USD); Mounting Technology: Surface Mount; Pins: 2; Case/Package: 0402; Package Shape: Rectangular; Terminal Finish: Nickel; Min Operating Temperature: -55°C; Max Operating Temperature: 155°C; Resistor Type: FIXED RESISTOR; Construction: Chip; Package Style: SMTMeter; Packaging: Tape and Reel; Technology: METAL GLAZE/THICK FILM; Termination: Wraparound; JESD-609 Code: e3; Reach SVHC Compliant: Yes; RoHS Compliant: Yes; ComponentLink1URL: https://datasheet.ciiva.com:443/pdfs/VipMasterIC/IC/YAGO/YAGO-S-A0008145938/YAGO-S-A0008145938-1.pdf?src-supplier=IHS+Markit; ComponentLink1Description: https://datasheet.ciiva.com:443/pdfs/VipMasterIC/IC/YAGO/YAGO-S-A0008145938/YAGO-S-A0008145938-1.pdf?src-supplier=IHS+Markit; ComponentLink2URL: https://datasheet.ciiva.com/7983/1018594-7983528.pdf?src-supplier=Element14; ComponentLink2Description: https://datasheet.ciiva.com/7983/1018594-7983528.pdf?src-supplier=Element14; ComponentLink3URL: https://datasheet.ciiva.com/5562/pyu-rc0402-51-rohs-l-6-r-5562837.pdf?src-supplier=Mouser; ComponentLink3Description: https://datasheet.ciiva.com/5562/pyu-rc0402-51-rohs-l-6-r-5562837.pdf?src-supplier=Mouser; ComponentLink4URL: https://datasheet.ciiva.com/2553/pyu-r-int-thick-7-2553209.pdf?src-supplier=Digikey; ComponentLink4Description: https://datasheet.ciiva.com/2553/pyu-r-int-thick-7-2553209.pdf?src-supplier=Digikey; ComponentLink5URL: https://datasheet.ciiva.com/2553/pyu-r-int-thick-7-2553210.pdf?src-supplier=Digikey; ComponentLink5Description: https://datasheet.ciiva.com/2553/pyu-r-int-thick-7-2553210.pdf?src-supplier=Digikey; ComponentLink6URL: https://datasheet.ciiva.com/2553/pyu-r-int-thick-7-2553211.pdf?src-supplier=Digikey; ComponentLink6Description: https://datasheet.ciiva.com/2553/pyu-r-int-thick-7-2553211.pdf?src-supplier=Digikey; ComponentLink7URL: https://datasheet.ciiva.com/16742/pyu-rc0402-51-rohs-l-6-r-16742220.pdf?src-supplier=Future+Electronics; ComponentLink7Description: https://datasheet.ciiva.com/16742/pyu-rc0402-51-rohs-l-6-r-16742220.pdf?src-supplier=Future+Electronics
SW1 = 218-4LPST: SWITCH SLIDE DIP SPST 25MA 24V; Manufacturer: CTS Electrocomponents; Actuator Level: Flush, Recessed; Actuator Type: Slide (Standard); Number of Positions: 4; Pitch: 0.050" (1.27mm), Half; Voltage Rating: 24VDC; Washable: Yes; Part Number: 218-4LPST; Circuit: SPST; ComponentLink1Description: Datasheet; ComponentLink1URL: https://www.ctscorp.com/wp-content/uploads/218.pdf; ComponentLink2Description: DigiKey Link; ComponentLink2URL: http://digikey.com/product-detail/en/cts-electrocomponents/218-4LPST/CT2184LPST-ND/267320; Contact Finish: Gold; Contact Material: Beryllium Copper; Current Rating (Amps): 25mA; Features: Epoxy Sealed Terminals, Tape Seal; Height Above Board: 0.104" (2.65mm); LastUpdated: 1/4/2020 7:03:56 PM; Lifecycle Status: Active; Minimum Order: 1; Mounting Type: Surface Mount; Operating Temperature: -55°C ~ 85°C; Packaging: Tube; PartId: 10; Part Status: Active; Price: 1.18; Series: 218; Supplier 1: DigiKey; Supplier Part Number 1: CT2184LPST-ND; Termination Style: Gull Wing
U1 U4 = NC7WV125K8X: Integrated Circuit; Manufacturer_Name: ON Semiconductor; Datasheet Link: https://www.mouser.com/datasheet/2/308/NC7WV125-1301459.pdf; Height: 0.9mm; Manufacturer_Part_Number: NC7WV125K8X; Mouser Part Number: 512-NC7WV125K8X; Mouser Price/Stock: https://www.mouser.com/Search/Refine.aspx?Keyword=512-NC7WV125K8X; Arrow Part Number: NC7WV125K8X; Arrow Price/Stock: https://www.arrow.com/en/products/nc7wv125k8x/on-semiconductor
U2 U3 U5 = 74LVC1G3157FZ4-7: Analog Switch Single SPDT 6-Pin X2-DFN T/R; Package: None; Price: None; Value: *; MP: 74LVC1G3157FZ4-7; Availability: Unavailable
U6 = CMP-0240-00158-1: Synchronous rectification with inhibit, 1.5 A, 1.5 MHz adjustable, step-down switching regulator, 6-Pin DFN; Manufacturer: STMicroelectronics; Min Input Voltage: 2.7V; Number of Outputs: 1; Output Current: 1.5A; Output Voltage: 3.3V; Max Supply Voltage: 6V; Switching Frequency: 1.5MHz; Output Type: Fixed,Adjustable; Quiescent Current: 1.5mA; Efficiency: 90%; Synchronous Rectifier: Yes; Polarity: Positive; Accuracy: 2%; PackageDescription: 6-Pin Plastic, Dual LLP, 3 x 3 mm Body, 0.95 mm Pitch, Exposed Pad; ComponentLink1URL: http://www.st.com; DatasheetVersion: May-2009; ComponentLink2Description: Datasheet; ComponentLink2URL: http://www.st.com/internet/com/TECHNICAL_RESOURCES/TECHNICAL_LITERATURE/DATASHEET/CD00100211.pdf; PackageVersion: 2008; PackageReference: DFN6D; ComponentLink1Description: Manufacturer URL; Supplier: Digikey; Supplier Part Number: 497-6311-1-ND; Manufacturer Part Number: ST1S06PU33R; RoHS: Yes; Category: Voltage Regulators - Switching; Stock: 5274; Pricing: 1=1.46, 10=1.306, 25=1.2392, 100=1.0179, 250=0.95156, 500=0.8409, 1000=0.66387 (USD); Mounting Technology: Surface Mount; Case/Package: DFN; Pins: 6; Weight: 0.000744oz; Min Operating Temperature: -30°C; Max Operating Temperature: 125°C; Packaging: Tape and Reel; Max Output current: 1.5A; Series: -; Package Quantity: 1; Operating Supply Voltage: 6V; Frequency: 1.5MHz; Length: 3.1mm; Width: 3.1mm; Height: 0.95mm; Radiation Hardening: No; Lead Free: Lead Free; RoHS Compliant: Yes; ComponentLink3URL: https://datasheet.ciiva.com/15113/getdatasheetpartid-188384-15113793.pdf?src-supplier=Verical; ComponentLink3Description: https://datasheet.ciiva.com/15113/getdatasheetpartid-188384-15113793.pdf?src-supplier=Verical; ComponentLink4URL: https://datasheet.ciiva.com/2029/cd00100211-2029328.pdf?src-supplier=Digikey; ComponentLink4Description: https://datasheet.ciiva.com/2029/cd00100211-2029328.pdf?src-supplier=Digikey; ComponentLink5URL: https://datasheet.ciiva.com/2029/cd00100211-2029329.pdf?src-supplier=Digikey; ComponentLink5Description: https://datasheet.ciiva.com/2029/cd00100211-2029329.pdf?src-supplier=Digikey; ComponentLink6URL: https://datasheet.ciiva.com/2029/cd00100211-2029330.pdf?src-supplier=Digikey; ComponentLink6Description: https://datasheet.ciiva.com/2029/cd00100211-2029330.pdf?src-supplier=Digikey; ComponentLink7URL: https://datasheet.ciiva.com/16489/cd00100211-16489901.pdf?src-supplier=Future+Electronics; ComponentLink7Description: https://datasheet.ciiva.com/16489/cd00100211-16489901.pdf?src-supplier=Future+Electronics; ComponentLink8URL: https://datasheet.ciiva.com/4905/cd00100211-4905371.pdf?src-supplier=Mouser; ComponentLink8Description: https://datasheet.ciiva.com/4905/cd00100211-4905371.pdf?src-supplier=Mouser
U7 = IC_AX88279
U8 = CMP-00252-18686437-1: SST25VF016B-50-4I-QAF-T Flash Serial-SPI 3.3V 16Mbit 2M x 8bit 8ns 8-Pin WSON EP T/R - Tape and Reel; Max Supply Voltage: 3.6V; Density: 16Mb; Interface: SPI; Memory Size: 2MB; Data Bus Width: 8b; Max Frequency: 50MHz; Nominal Supply Current: 15mA; Address Bus Width: 1b; Min Supply Voltage: 2.7V; Sync/Async: Synchronous; Packaging: Tape and Reel; Operating Supply Voltage: 3.3V; Access Time: 8ns; Lead Free: Lead Free; Height: 800µm; RoHS: Compliant; Max Operating Temperature: 85°C; Lifecycle Status: Production; NexarPartId: 18686437; Frequency: 50MHz; Schedule B: 8542320050, 8542320050; Min Operating Temperature: -40°C; Word Size: 8b; Memory Type: FLASH; Number of Pins: 8; Radiation Hardening: No; Mount: Surface Mount
U9 = CMP-0240-00159-1: Synchronous rectification with inhibit, 1.5 A, 1.5 MHz adjustable, step-down switching regulator, 6-Pin DFN; PackageDescription: 6-Pin Plastic, Dual LLP, 3 x 3 mm Body, 0.95 mm Pitch, Exposed Pad; ComponentLink2URL: http://www.st.com/internet/com/TECHNICAL_RESOURCES/TECHNICAL_LITERATURE/DATASHEET/CD00100211.pdf; ComponentLink1Description: Manufacturer URL; DatasheetVersion: May-2009; ComponentLink1URL: http://www.st.com; ComponentLink2Description: Datasheet; PackageVersion: 2008; PackageReference: DFN6D
Y1 = CMP-27762-002203-1: Crystal 25MHz ±20ppm 18pF SMD-2 5mm x 3.2mm; Manufacturer: Abracon; Series Resistance: 30R; Frequency Stability: 30ppm; Operating Frequency-Nom: 250; Aging: 5 PPM/FIRST YEAR; Crystal/Resonator Type: PARALLEL - FUNDAMENTAL; Drive Level: 10uW; ESR: 50R; Load Capacitance: 18pF; Length: 5mm; Operating Frequency: 25 MHz; Number of Pins: 2; Depth: 3.2mm; Case/Package: CSMD; Packaging: Tape and Reel; Min Operating Temperature: -40°C; Width: 3.2mm; Termination: SMD/SMT; Lead Free: Lead Free; Frequency: 25MHz; Frequency Tolerance: 20ppm; ESR (Equivalent Series Resistance): 30R; Package Quantity: 1000; Max Operating Temperature: 85°C; Height: 0.051inch; Series: ABM3; REACH SVHC: Yes; Mount: Surface Mount; Resistor Type: Ceramic; Tolerance: 20ppm; Supplier: Digikey; Supplier Part Number: 535-10645-1-ND; Manufacturer Part Number: ABM3-25.000MHZ-D2Y-T; RoHS: Yes; Category: Crystals; Stock: 31136; Pricing: 1=0.59, 10=0.505, 50=0.4552, 100=0.4354, 500=0.39268 (USD); Mounting Technology: Surface Mount; Terminal Finish: Silver; JESD-609 Code: e4; Reach SVHC Compliant: Yes; RoHS Compliant: Yes; ComponentLink1URL: https://datasheet.ciiva.com:443/pdfs/VipMasterIC/IC/ABRC/ABRCS03152/ABRCS03152-1.pdf?src-supplier=IHS+Markit; ComponentLink1Description: https://datasheet.ciiva.com:443/pdfs/VipMasterIC/IC/ABRC/ABRCS03152/ABRCS03152-1.pdf?src-supplier=IHS+Markit; ComponentLink2URL: https://datasheet.ciiva.com/855/abm3-855867.pdf?src-supplier=Digikey; ComponentLink2Description: https://datasheet.ciiva.com/855/abm3-855867.pdf?src-supplier=Digikey; ComponentLink3URL: https://datasheet.ciiva.com/855/abm3-855868.pdf?src-supplier=Digikey; ComponentLink3Description: https://datasheet.ciiva.com/855/abm3-855868.pdf?src-supplier=Digikey; ComponentLink4URL: https://datasheet.ciiva.com/855/abm3-855869.pdf?src-supplier=Digikey; ComponentLink4Description: https://datasheet.ciiva.com/855/abm3-855869.pdf?src-supplier=Digikey; ComponentLink5URL: https://datasheet.ciiva.com/16223/abm3-16223368.pdf?src-supplier=Future+Electronics; ComponentLink5Description: https://datasheet.ciiva.com/16223/abm3-16223368.pdf?src-supplier=Future+Electronics; ComponentLink6URL: https://datasheet.ciiva.com/7998/abm3-7998575.pdf?src-supplier=Element14; ComponentLink6Description: https://datasheet.ciiva.com/7998/abm3-7998575.pdf?src-supplier=Element14